# EAGLE design Wilamowski (EAGLE 9.6.2)
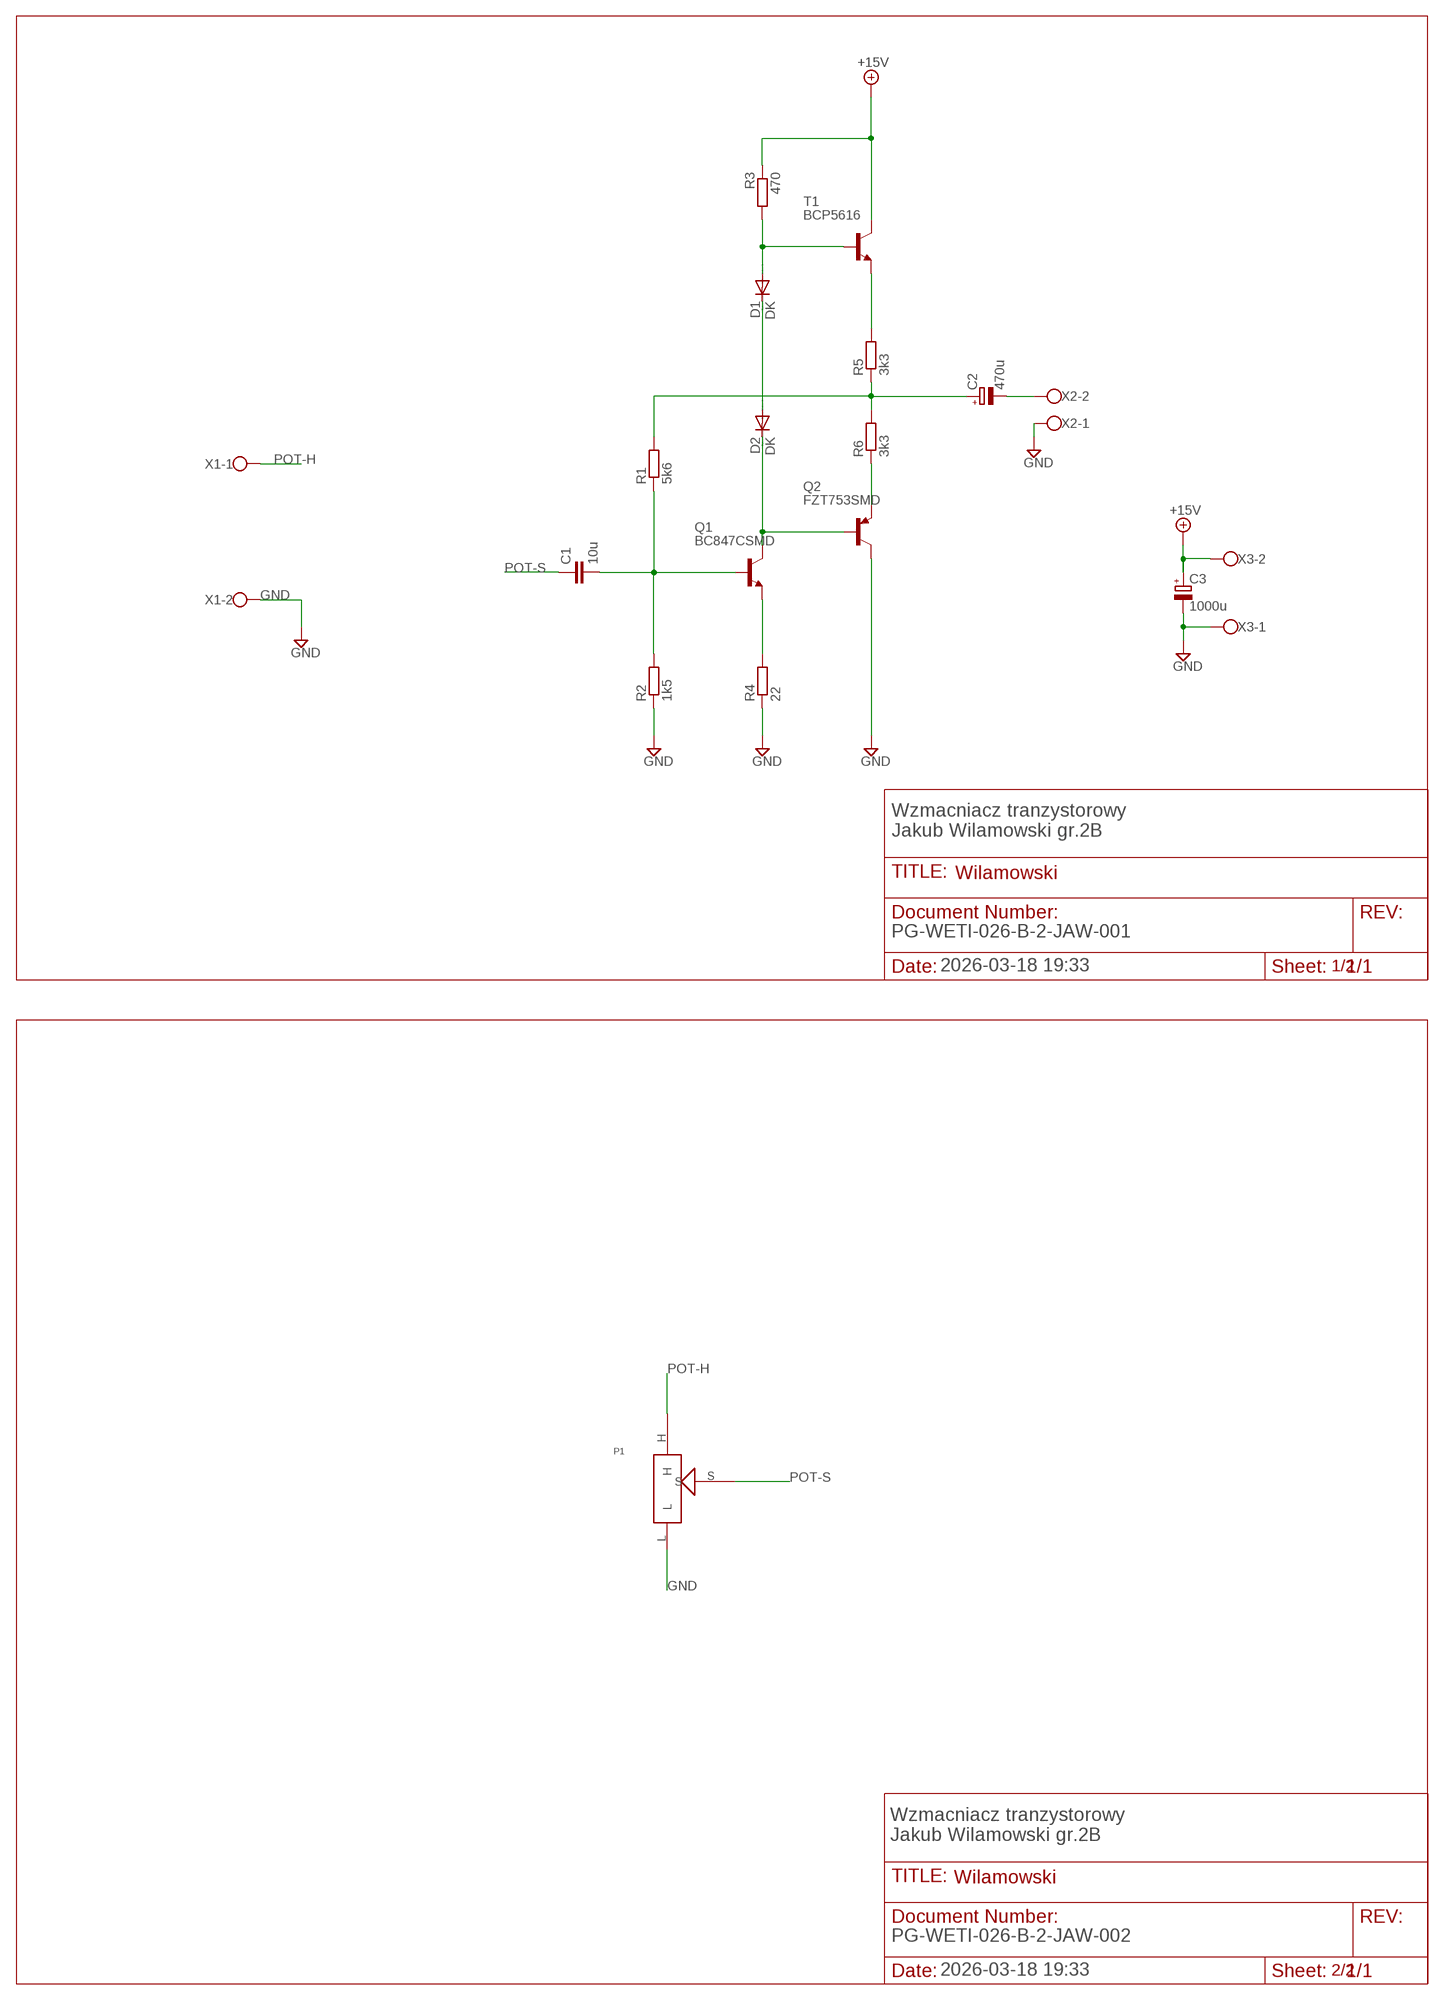
[diagram p0: schematic, sheet 1]

## Parts
C1  10u  C-EU025-024X044  [C025-024X044]
C2  470u  CPOL-EU139CLL-3R  [139CLL-3R]
C3  1000u  CPOL-EU139CLL-3R  [139CLL-3R]
D1  DK  DIODE-SOD106-R  [SOD106-R]
D2  DK  DIODE-SOD106-R  [SOD106-R]
P1  POTENCJOMETRSMD  [1804(3314)]
Q1  BC847CSMD  [SOT23]
Q2  FZT753SMD  [SOT223]
R1  5k6  R-EU_R2010  [R2010]
R2  1k5  R-EU_R2010  [R2010]
R3  470  R-EU_R2010  [R2010]
R4  22  R-EU_R2010  [R2010]
R5  3k3  R-EU_R2010  [R2010]
R6  3k3  R-EU_R2010  [R2010]
T1  BCP5616  -NPN-SOT223  [SOT223]
X1  W237-102  [W237-102]
X2  W237-102  [W237-102]
X3  W237-102  [W237-102]

## Nets
+15V: C3.+ R3.1 T1.4(C) X3.2
GND: C3.- P1.L Q2.2(C) Q2.4(C) R2.1 R4.1 X1.2 X2.1 X3.1
N$1: D2.C Q1.3(C) Q2.1(B)
N$2: R5.2 T1.3(E)
N$3: C2.+ R1.2 R5.1 R6.2
N$4: Q2.3(E) R6.1
N$5: D1.A R3.2 T1.1(B)
N$6: C2.- X2.2
N$7: D1.C D2.A
N$8: C1.2 Q1.1(B) R1.1 R2.2
N$9: Q1.2(E) R4.2
POT-H: P1.H X1.1
POT-S: C1.1 P1.S

## Notes on the sheet
- Wzmacniacz tranzystorowy
  Jakub Wilamowski gr.2B
- PG-WETI-026-B-2-JAW-001
- 2026-03-18 19:33 | 1/2
- Wzmacniacz tranzystorowy
  Jakub Wilamowski gr.2B
- PG-WETI-026-B-2-JAW-002
- 2026-03-18 19:33 | 2/2

## Library data of the parts
C1 = rcl:C-EU: CAPACITOR, European symbol
C2 C3 = rcl:CPOL-EU: POLARIZED CAPACITOR, European symbol
D1 D2 = diode:DIODE-: DIODE
P1 = Wilamowski:POTENCJOMETR
Q1 = transistor-npn:BC847*: NPN Transistor
Q2 = transistor-pnp:FZT753SMD: PNP Transistor
R1-R6 = rcl:R-EU_: RESISTOR, European symbol
T1 = transistor-neu-to92:*-NPN-: NPN Transistror
X1-X3 = con-wago-500:W237-102: WAGO SCREW CLAMP; MPN: 237-102; OC_FARNELL: unknown; OC_NEWARK: 70K9898

## Board
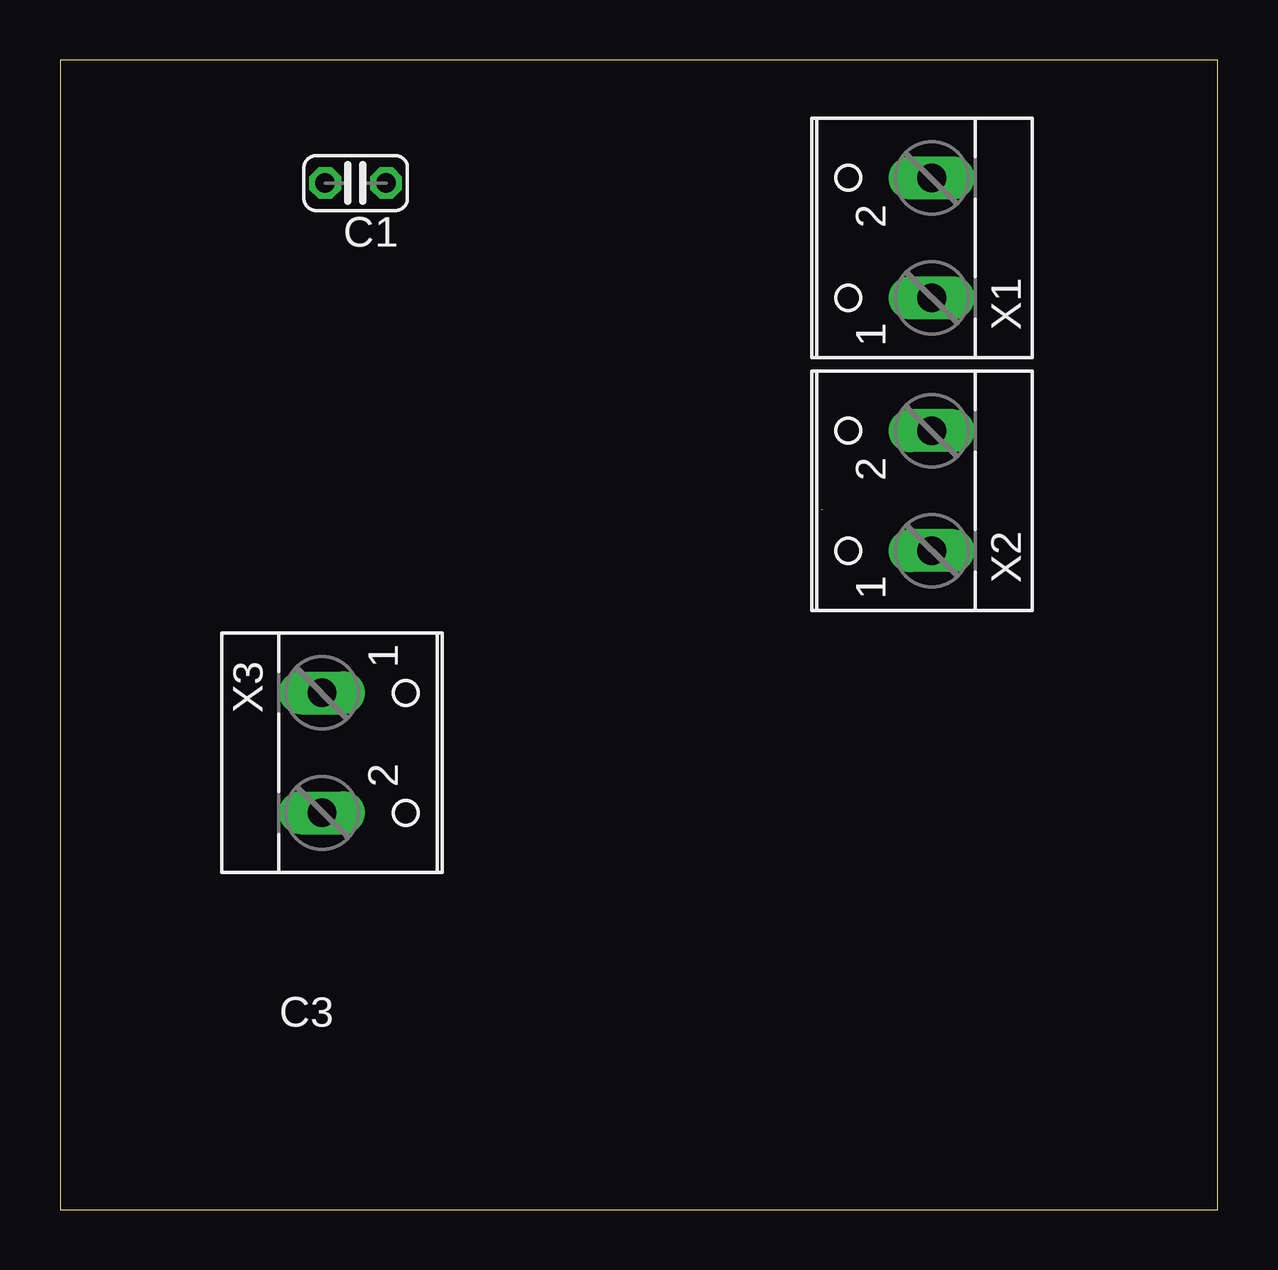
[diagram p1: board, top side]
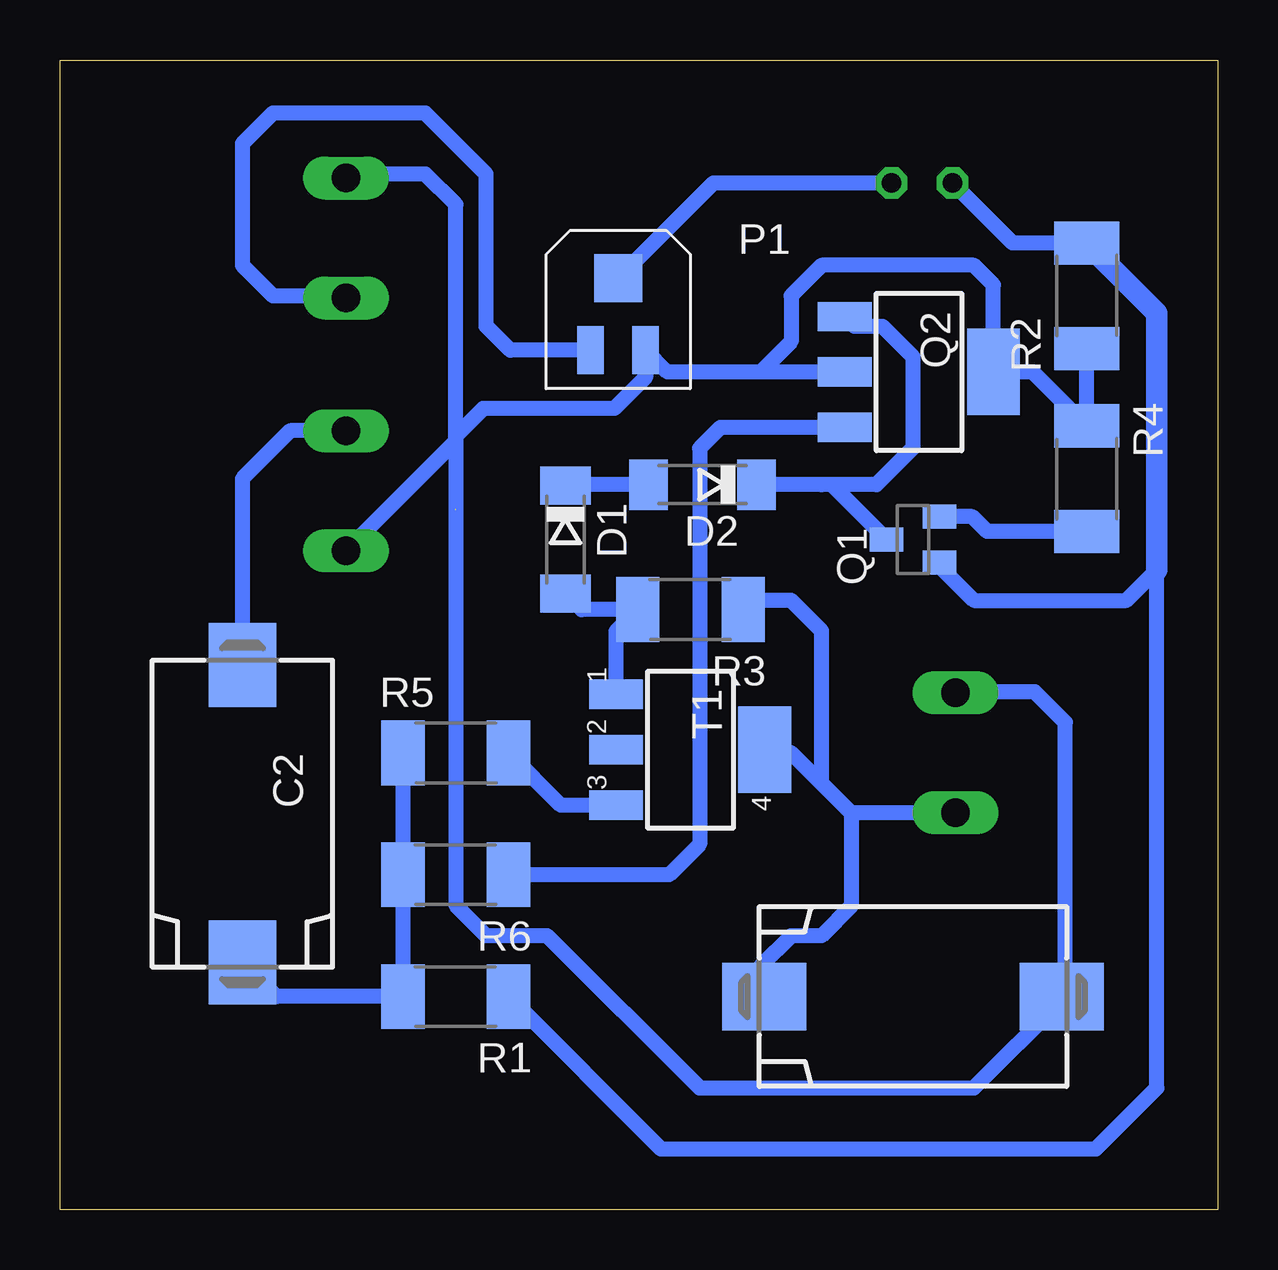
[diagram p2: board, bottom side, seen from below]

Size 48.24 x 47.93 mm. Coordinates in mm from the lower left corner, seen from the top.
Outline: 0,0 48.24,0 48.24,47.93 0,47.93 0,0
Copper layers (1*16): Top 0.035mm / dielectric 1.5mm / Bottom 0.035mm
Design rules "default *": minimum track width 6mil, minimum drill 0.35mm, track to track 15mil, track to pad 15mil, pad to pad 15mil, via to via 15mil, smd to smd 15mil, copper to edge 40mil, drill to drill 6mil, minimum pad ring 10mil, minimum via ring 8mil, stop-mask expansion 4mil, vias tented up to drill 0mil, thermal gap 10mil

### Footprints (pad centres in the part's own frame; a part is rotated, then mirrored left to right if it is on the bottom)
C025-024X044 = drill 0.813 octagon: 1 -1.27,0; 2 1.27,0
139CLL-3R = smd 3.5 x 2.8: + 6.2,0; - -6.2,0
SOD106-R = smd 1.6 x 2.1: A 2.25,0; C -2.25,0
1804(3314) = smd 1.1 x 2: H 4.85,7; L 7.15,7 | smd 2 x 2: S 6,10
SOT23 = smd 1 x 1.4: 1 -0.95,-1.1; 2 0.95,-1.1; 3 0,1.1
SOT223 = smd 1.219 x 2.235: 1 -2.311,-3.099; 2 0,-3.099; 3 2.311,-3.099 | smd 3.6 x 2.2: 4 0,3.099
R2010 = smd 1.8 x 2.7: 1 -2.2,0; 2 2.2,0
W237-102 = drill 1.194 long: 1 -2.5,-1.27; 2 2.5,-1.27

### Placement (x,y rotation side)
C1  12.32,42.8 180 top
C2  40.64,16.51 270 bottom
C3  12.7,8.89 180 bottom
D1  27.18,27.94 270 bottom
D2  21.46,30.23 180 bottom
P1  30.99,28.83 0 bottom
Q1  12.7,27.94 90 bottom
Q2  12.45,34.92 270 bottom
R1  31.75,8.89 180 bottom
R2  5.46,38.1 90 bottom
R3  21.97,25.02 180 bottom
R4  5.46,30.48 270 bottom
R5  31.75,19.05 0 bottom
R6  31.75,13.97 180 bottom
T1  21.97,19.18 270 bottom
X1  35.05,40.51 90 top
X2  35.05,29.97 90 top
X3  12.19,19.05 270 top

### Tracks (layer width: path | path; a pad name or v marks a point on that pad's centre or on a via)
+15V
  Bottom 0.635: X3.2 15.28,16.55 | 15.28,16.55 16.51,17.78 | 16.51,17.78 16.51,24.13 17.78,25.4 19.39,25.4 R3.1 | 16.51,17.78 17.78,19.05 18.75,19.05 T1.4 | 15.28,16.55 15.28,12.66 16.51,11.43 17.78,11.43 19.05,10.16 19.05,9.04 C3.+
GND  (1 unrouted)
  Bottom 0.635: R2.1 R4.1 7.71,34.92 Q2.4 9.35,38.56 10.16,39.37 16.51,39.37 17.78,38.1 17.78,36.2 19.05,34.92 | 31.75,29.17 31.75,12.7 30.48,11.43 27.94,11.43 21.59,5.08 10.16,5.08 6.5,8.74 C3.- 6.35,8.89 6.35,20.32 7.62,21.59 10.88,21.59 X3.1 | Q2.2 19.05,34.92 | 19.05,34.92 22.93,34.92 P1.L 23.84,34.71 25.15,33.4 30.61,33.4 31.75,32.26 31.75,32.04 | 31.75,32.04 31.75,31.62 31.75,29.21 | 31.75,32.04 31.75,41.91 33.02,43.18 36.16,43.18 X1.2 | X2.1 31.75,32.04
N$1
  Bottom 0.635: Q2.1 15.14,36.83 13.97,36.83 12.7,35.56 12.7,31.75 14.22,30.23 16.09,30.23 | D2.C 16.51,30.23 16.09,30.23 | Q1.3 16.09,30.23
N$2
  Bottom 0.635: T1.3 27.37,16.87 R5.2
N$3
  Bottom 0.635: C2.+ 39.22,8.89 R1.2 R6.2 R5.1
N$4
  Bottom 0.635: Q2.3 20.73,32.61 21.59,31.75 21.59,15.24 22.86,13.97 R6.1
N$5
  Bottom 0.635: D1.A 26.51,25.02 R3.2 25.07,24.12 T1.1
N$6
  Bottom 0.635: X2.2 38.65,32.47 40.64,30.48 C2.-
N$7
  Bottom 0.635: D2.A 27.14,30.23 D1.C
N$8
  Bottom 0.635: Q1.1 11.6,26.84 10.16,25.4 3.81,25.4 2.54,26.67 2.54,5.08 5.08,2.54 23.2,2.54 R1.1 | R2.2 8.55,40.3 C1.2
  Bottom 0.889: R2.2 2.54,37.38 2.54,26.67
N$9
  Bottom 0.635: R4.2 9.61,28.28 10.22,28.89 Q1.2
POT-H
  Bottom 0.635: P1.H 29.48,35.83 30.48,36.83 30.48,43.18 33.02,45.72 39.37,45.72 40.64,44.45 40.64,39.37 39.37,38.1 36.41,38.1 X1.1
POT-S
  Bottom 0.635: C1.1 21.02,42.8 P1.S